# EAGLE schematic emote-esp8266 (EAGLE 8.3.2)
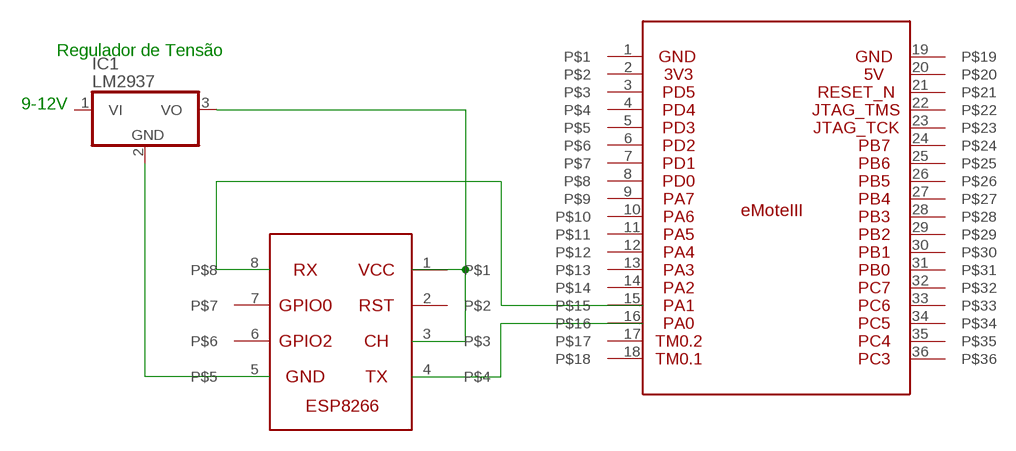
[diagram p0: schematic, sheet 1]

## Parts
IC1  LM2937  [TO263-3]
U$1  EMOTE3  [2X18]
U$2  ESP8266  [332-08]

## Nets
N$1: U$1.16 U$2.4
N$2: U$1.15 U$2.8
N$3: IC1.3(VO) U$2.1 U$2.3
N$4: IC1.2(GND) U$2.5
Unconnected: IC1.1(VI) U$1.1 U$1.2 U$1.3 U$1.4 U$1.5 U$1.6 U$1.7 U$1.8 U$1.9 U$1.10 U$1.11 U$1.12 U$1.13 U$1.14 U$1.17 U$1.18 U$1.19 U$1.20 U$1.21 U$1.22 U$1.23 U$1.24 U$1.25 U$1.26 U$1.27 U$1.28 U$1.29 U$1.30 U$1.31 U$1.32 U$1.33 U$1.34 U$1.35 U$1.36 U$2.2 U$2.6 U$2.7

## Notes on the sheet
- Regulador de Tensão
- 9-12V

## Library data of the parts
IC1 = linear:LM2937: LM2937-2.5, LM2937-3.3 400mA and 500mA Voltage Regulators Source: http://cache.national.com/ds/LM/LM2937-2.5.pdf
U$1 = emote3:EMOTE3
U$2 = esp8266:ESP8266